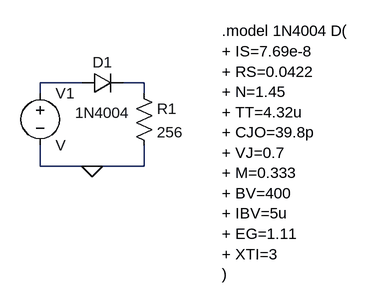
[diagram p0: schematic SIM1N4004.asc]
SIM1N4004.asc, the LTspice schematic file:
Version 4
SHEET 1 880 680
WIRE 64 80 0 80
WIRE 160 80 128 80
WIRE 0 96 0 80
WIRE 160 96 160 80
WIRE 0 208 0 176
WIRE 80 208 0 208
WIRE 160 208 160 176
WIRE 160 208 80 208
FLAG 80 208 0
SYMBOL voltage 0 80 R0
SYMATTR InstName V1
SYMBOL diode 64 96 R270
WINDOW 0 32 32 VTop 2
WINDOW 3 -14 32 VBottom 2
SYMATTR InstName D1
SYMATTR Value 1N4004
SYMBOL res 144 80 R0
SYMATTR InstName R1
SYMATTR Value 256
TEXT 280 0 Left 2 !.model 1N4004 D(\n+ IS=7.69e-8\n+ RS=0.0422\n+ N=1.45\n+ TT=4.32u\n+ CJO=39.8p\n+ VJ=0.7\n+ M=0.333\n+ BV=400\n+ IBV=5u\n+ EG=1.11\n+ XTI=3\n)

The netlist it stands for:
* SIM1N4004.asc
V1 N001 0 V
D1 N001 N002 1N4004
R1 N002 0 256
.model D D
.lib standard.dio
.model 1N4004 D(
+ IS=7.69e-8
+ RS=0.0422
+ N=1.45
+ TT=4.32u
+ CJO=39.8p
+ VJ=0.7
+ M=0.333
+ BV=400
+ IBV=5u
+ EG=1.11
+ XTI=3
)
.backanno
.end